# EAGLE design Syn-ShieldCarger-v07 (EAGLE 5.10)
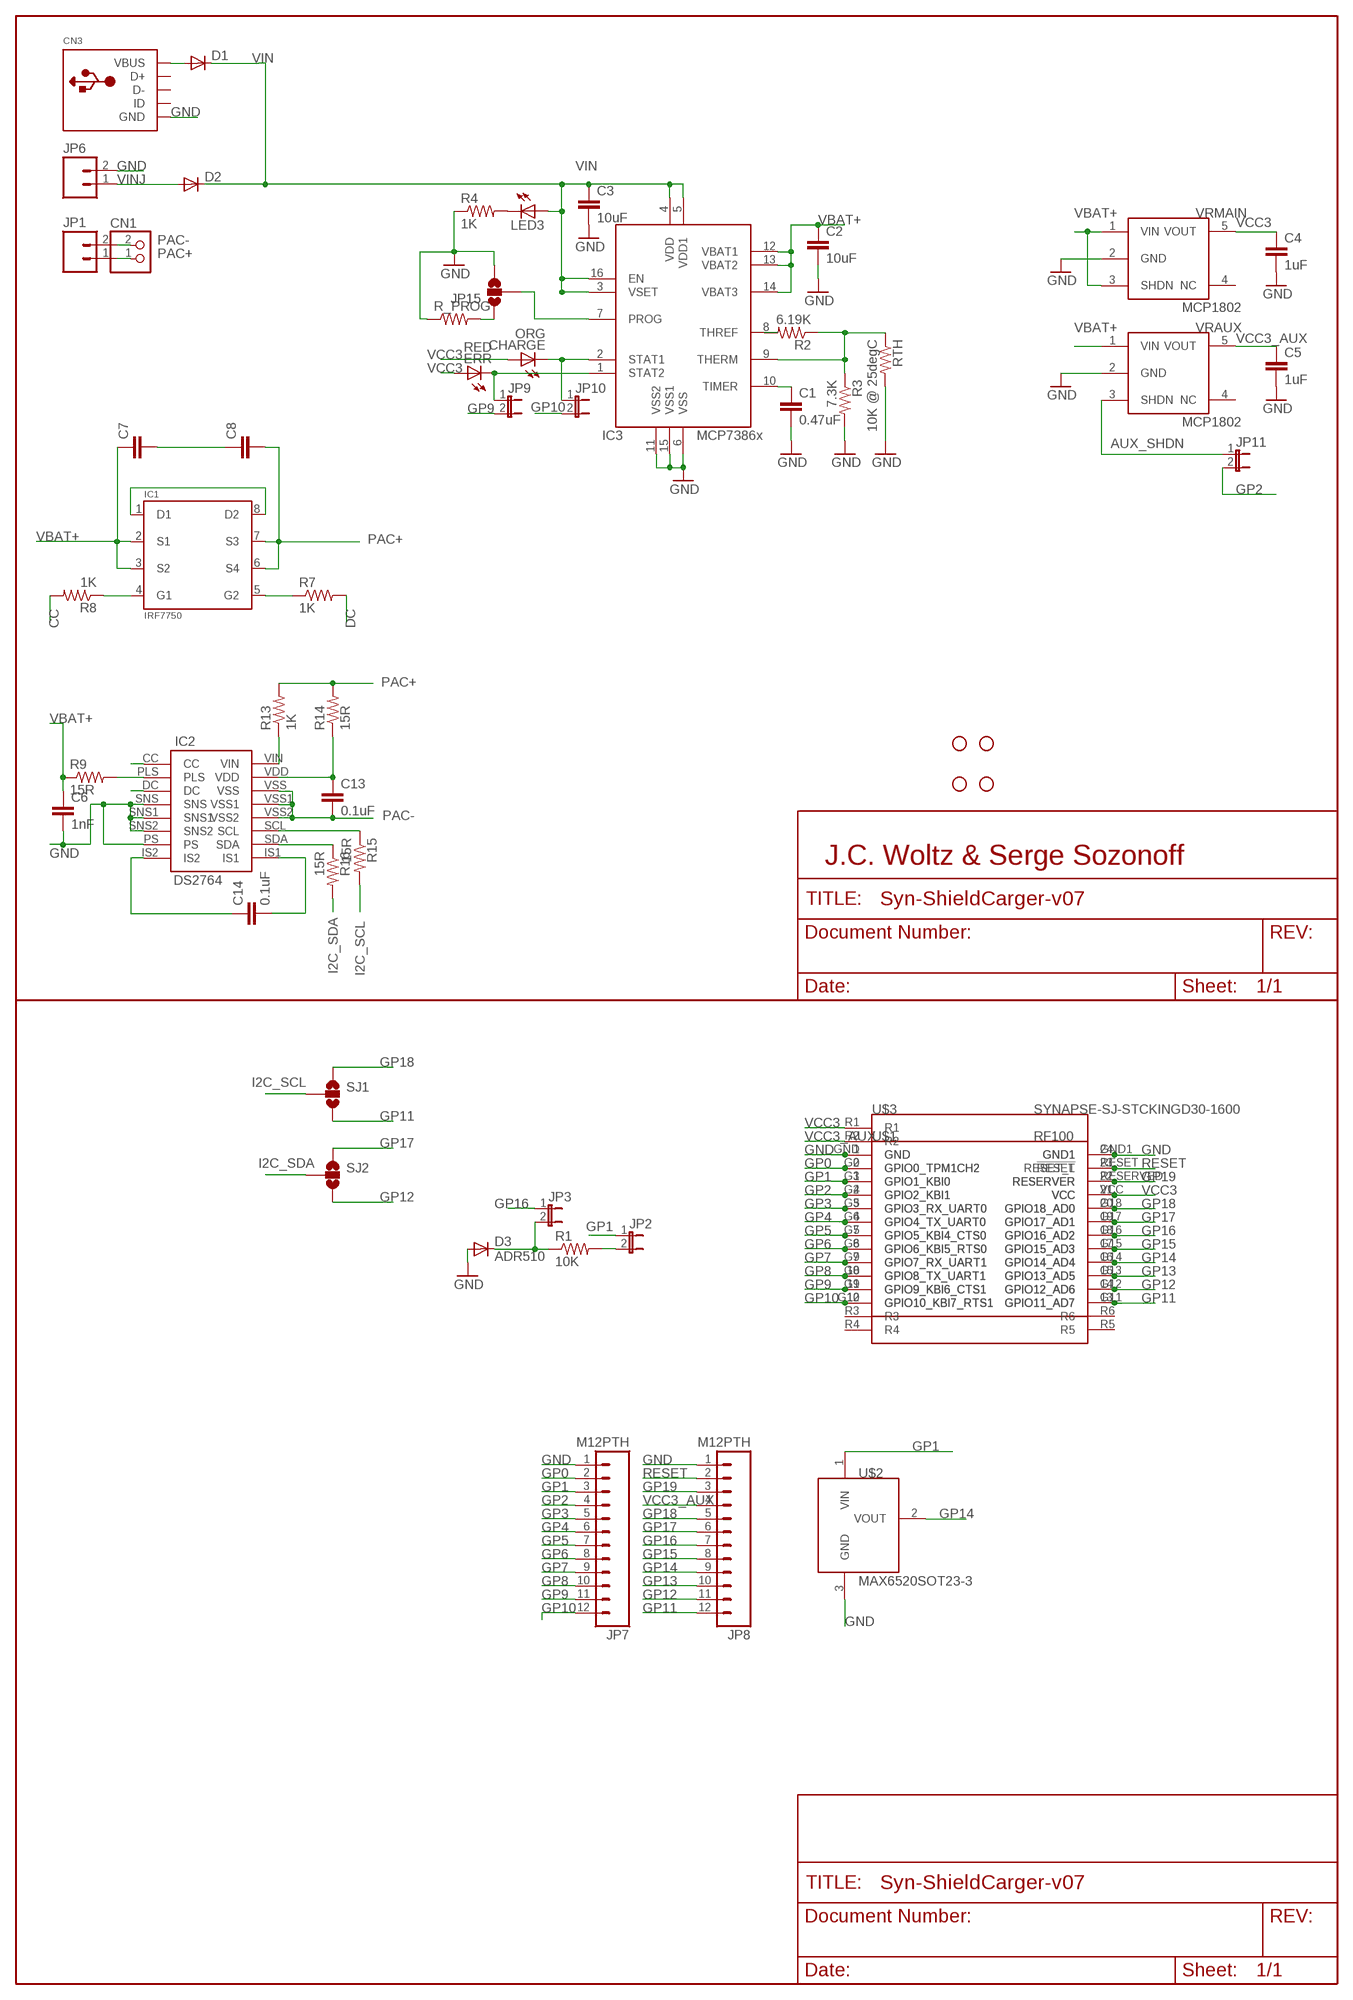
[diagram p0: schematic, sheet 1]

## Parts
C1  0.47uF  CAP0603-CAP  [0603-CAP]
C2  10uF  CAP1206  [1206]
C3  10uF  CAP1206  [1206]
C4  1uF  CAP0603-CAP  [0603-CAP]
C5  1uF  CAP0603-CAP  [0603-CAP]
C6  1nF  CAP0603-CAP  [0603-CAP]
C7  CAP0603-CAP  [0603-CAP]
C8  CAP0603-CAP  [0603-CAP]
C13  0.1uF  CAP0603-CAP  [0603-CAP]
C14  0.1uF  CAP0603-CAP  [0603-CAP]
CHARGE  ORG  LEDCHIPLED_0603  [CHIPLED_0603]
CN1  JST_2PIN-THM-RA  [JST-PH-2-THM-RA]
CN3  USBMINIB  [USB-MINIB]
D1  DIODESOD  [SOD-323]
D2  DIODESMA  [SMA-DIODE]
D3  ADR510  DIODESOT-23-3-ADR510  [SOT23-3]
ERR  RED  LEDCHIPLED_0603  [CHIPLED_0603]
IC1  IRF7750  [TSSOP8-4.4MM]
IC2  DS2764  [DS2764]
IC3  MCP73861SO16  [SO16-150MIL]
JP1  M02PTH  [1X02]
JP2  JUMPER-2SMD-NC  [SJ_2S]
JP3  JUMPER-2SMD-NC  [SJ_2S]
JP4  STAND-OFF  [STAND-OFF]
JP5  STAND-OFF  [STAND-OFF]
JP6  M023.5MM  [SCREWTERMINAL-3.5MM-2]
JP7  M12PTH  [1X12]
JP8  M12PTH  [1X12]
JP9  JUMPER-2SMD-NC  [SJ_2S]
JP10  JUMPER-2SMD-NC  [SJ_2S]
JP11  JUMPER-2SMD-NC  [SJ_2S]
JP12  STAND-OFF  [STAND-OFF]
JP15  SOLDERJUMPER_2WAYT  [SJ_2]
JP17  STAND-OFF  [STAND-OFF]
LED3  LEDCHIPLED_0603  [CHIPLED_0603]
R1  10K  RESISTOR0603-RES  [0603-RES]
R2  6.19K  RESISTOR0603-RES  [0603-RES]
R3  7.3K  RESISTOR0603-RES  [0603-RES]
R4  1K  RESISTOR0603-RES  [0603-RES]
R7  1K  RESISTOR0603-RES  [0603-RES]
R8  1K  RESISTOR0603-RES  [0603-RES]
R9  15R  RESISTOR0603-RES  [0603-RES]
R13  1K  RESISTOR0603-RES  [0603-RES]
R14  15R  RESISTOR0603-RES  [0603-RES]
R15  15R  RESISTOR0603-RES  [0603-RES]
R16  15R  RESISTOR0603-RES  [0603-RES]
R_PROG  RESISTORAXIAL-0603  [AXIAL-0603]
RTH  10K @ 25degC  RESISTORAXIAL-0603  [AXIAL-0603]
SJ1  SOLDERJUMPER_2WAYS  [SJ_3]
SJ2  SOLDERJUMPER_2WAYS  [SJ_3]
U$1  SYNAPSEWIRELESS-RFENGINESTD  SYNAPSEWIRELESS-RFENGINESTDTHM  [SYNAPSERFENGINE-THM]
U$2  MAX6520SOT23-3  [SOT23-3]
U$3  SYNAPSE-SJ-STCKINGD30-1600  [SYNSJ-STACK]
VRAUX  MCP1802  [SOT23-5]
VRMAIN  MCP1802  [SOT23-5]

## Nets
AUX_SHDN: JP11.1 VRAUX.3(SHDN)
CC: IC2.CC R8.2
DC: IC2.DC R7.2
GND: C1.2 C2.2 C3.2 C4.2 C5.2 C6.2 CN3.GND D3.2(A) IC2.PS IC2.SNS IC2.SNS1 IC2.SNS2 IC3.6(VSS) IC3.11(VSS2) IC3.15(VSS1) JP6.2 JP7.1 JP8.1 JP15.3 R3.2 R4.1 R_PROG.P$1 RTH.P$2 U$1.1(GND) U$1.24(GND1) U$2.3(GND) U$3.GND U$3.GND1 VRAUX.2(GND) VRMAIN.2(GND)
GP0: JP7.2 U$1.2(GPIO0_TPM1CH2) U$3.G0(GPIO0_TPM1CH2)
GP1: JP2.1 JP7.3 U$1.3(GPIO1_KBI0) U$2.1(VIN) U$3.G1(GPIO1_KBI0)
GP2: JP7.4 JP11.2 U$1.4(GPIO2_KBI1) U$3.G2(GPIO2_KBI1)
GP3: JP7.5 U$1.5(GPIO3_RX_UART0) U$3.G3(GPIO3_RX_UART0)
GP4: JP7.6 U$1.6(GPIO4_TX_UART0) U$3.G4(GPIO4_TX_UART0)
GP5: JP7.7 U$1.7(GPIO5_KBI4_CTS0) U$3.G5(GPIO5_KBI4_CTS0)
GP6: JP7.8 U$1.8(GPIO6_KBI5_RTS0) U$3.G6(GPIO6_KBI5_RTS0)
GP7: JP7.9 U$1.9(GPIO7_RX_UART1) U$3.G7(GPIO7_RX_UART1)
GP8: JP7.10 U$1.10(GPIO8_TX_UART1) U$3.G8(GPIO8_TX_UART1)
GP9: JP7.11 JP9.2 U$1.11(GPIO9_KBI6_CTS1) U$3.G9(GPIO9_KBI6_CTS1)
GP10: JP7.12 JP10.2 U$1.12(GPIO10_KBI7_RTS1) U$3.G10(GPIO10_KBI7_RTS1)
GP11: JP8.12 SJ1.3 U$1.13(GPIO11_AD7) U$3.G11(GPIO11_AD7)
GP12: JP8.11 SJ2.3 U$1.14(GPIO12_AD6) U$3.G12(GPIO12_AD6)
GP13: JP8.10 U$1.15(GPIO13_AD5) U$3.G13(GPIO13_AD5)
GP14: JP8.9 U$1.16(GPIO14_AD4) U$2.2(VOUT) U$3.G14(GPIO14_AD4)
GP15: JP8.8 U$1.17(GPIO15_AD3) U$3.G15(GPIO15_AD3)
GP16: JP3.1 JP8.7 U$1.18(GPIO16_AD2) U$3.G16(GPIO16_AD2)
GP17: JP8.6 SJ2.1 U$1.19(GPIO17_AD1) U$3.G17(GPIO17_AD1)
GP18: JP8.5 SJ1.1 U$1.20(GPIO18_AD0) U$3.G18(GPIO18_AD0)
GP19: JP8.3 U$1.22(RESERVER) U$3.RESERVED(RESERVER)
I2C_SCL: R15.2 SJ1.2
I2C_SDA: R16.2 SJ2.2
N$1: IC1.1(D1) IC1.8(D2)
N$2: LED3.C R4.2
N$3: D3.1(C) JP3.2 R1.1
N$4: JP2.2 R1.2
N$5: IC1.4(G1) R8.1
N$6: IC3.7(PROG) JP15.2
N$7: IC3.8(THREF) R2.2
N$8: IC3.9(THERM) R2.1 R3.1 RTH.P$1
N$9: C1.1 IC3.10(TIMER)
N$10: JP15.1 R_PROG.P$2
N$14: IC1.5(G2) R7.1
N$15: IC2.VIN R13.1
N$16: C14.2 IC2.IS1
N$17: IC2.SCL R15.1
N$18: C13.1 IC2.VDD R14.1
N$19: C7.2 C8.1
N$21: CN3.VBUS D1.2(A)
N$24: C14.1 IC2.IS2
N$25: IC2.SDA R16.1
PAC+: C8.2 CN1.1 IC1.6(S4) IC1.7(S3) JP1.1 R13.2 R14.2
PAC-: C13.2 CN1.2 IC2.VSS IC2.VSS1 IC2.VSS2 JP1.2
PLS: IC2.PLS R9.2
RESET: JP8.2 U$1.23(RESET_L) U$3.RESET(!RESET)
STAT1: CHARGE.C IC3.2(STAT1) JP10.1
STAT2: ERR.C IC3.1(STAT2) JP9.1
VBAT+: C2.1 C6.1 C7.1 IC1.2(S1) IC1.3(S2) IC3.12(VBAT1) IC3.13(VBAT2) IC3.14(VBAT3) R9.1 VRAUX.1(VIN) VRMAIN.1(VIN) VRMAIN.3(SHDN)
VCC3: C4.1 CHARGE.A ERR.A U$1.21(VCC) U$3.R1 U$3.VCC VRMAIN.5(VOUT)
VCC3_AUX: C5.1 JP8.4 U$3.R2 VRAUX.5(VOUT)
VIN: C3.1 D1.1(C) D2.C IC3.3(VSET) IC3.4(VDD) IC3.5(VDD1) IC3.16(EN) LED3.A
VINJ: D2.A JP6.1
Unconnected: CN3.D+ CN3.D- CN3.ID U$3.R3 U$3.R4 U$3.R5 U$3.R6 VRAUX.4(NC) VRMAIN.4(NC)

## Notes on the sheet
- J.C. Woltz & Serge Sozonoff

## Library data of the parts
C1-C8 C13 C14 = SparkFun:CAP: Capacitor Standard 0603 ceramic capacitor, and 0.1" leaded capacitor.
CHARGE ERR LED3 = adafruit:LED: LED OSRAM: - CHIPLED LG R971, LG N971, LY N971, LG Q971, LY Q971, LO R971, LY R971 LH N974, LH R974 LS Q976, LO Q976, LY Q976 LO Q996 - Hyper CHIPLED LW Q18S LB Q993, LB Q99A, LB R99A - SideLED LS A670, LO A670, LY A670, LG A670, LP A670 LB A673, LV A673, LT A673, LW A673 LH A674 LY A675 LS A676, LA A676, LO A676, LY A676, LW A676 LS A679, LY A679, LG A679 - Hyper Micro SIDELED® LS Y876, LA Y876, LO Y876, LY Y876 LT Y87S - SmartLED LW L88C, LW L88S LB L89C, LB L89S, LG L890 LS L89K, LO L89K, LY L89K LS L896, LA L896, LO L896, LY L896 - TOPLED LS T670, LO T670, LY T670, LG T670, LP T670 LSG T670, LSP T670, LSY T670, LOP T670, LYG T670 LG T671, LOG T671, LSG T671 LB T673, LV T673, LT T673, LW T673 LH T674 LS T676, LA T676, LO T676, LY T676, LB T676, LH T676, LSB T676, LW T676 LB T67C, LV T67C, LT T67C, LS T67K, LO T67K, LY T67K, LW E67C LS E67B, LA E67B, LO E67B, LY E67B, LB E67C, LV E67C, LT E67C LW T67C LS T679, LY T679, LG T679 LS T770, LO T770, LY T770, LG T770, LP T770 LB T773, LV T773, LT T773, LW T773 LH T774 LS E675, LA E675, LY E675, LS T675 LS T776, LA T776, LO T776, LY T776, LB T776 LHGB T686 LT T68C, LB T68C - Hyper Mini TOPLED® LB M676 - Mini TOPLED Santana® LG M470 LS M47K, LO M47K, LY M47K Source: http://www.osram.convergy.de/
CN1 = adafruit:JST_2PIN: JST 2-Pin Connectors of various flavors SMT-RA (S2B-PH-SM4) 4UConnector #17311 SMT (B2B-PH-SM4) THM-RA (S2B-PH) THM (B2B-PH)
CN3 = adafruit:USB: USB Connectors USBMINIB - Surface Mount Female Mini-B USB Connector 4UConnector: 06564 By microbuilder.eu Thru-hole RA Female Mini-B USB Connector 4UConnector: 18732 By ladyada.net
D1 D2 = SparkFun:DIODE: Diode These are standard reverse protection diodes and small signal diodes. SMA package can handle up to about 1A. SOD-323 can handle about 200mA. What the SOD-323 package when ordering, there are some mfgs out there that are 5-pin packages.
D3 = 0_jc-modified:DIODE: Diode These are standard reverse protection diodes and small signal diodes. SMA package can handle up to about 1A. SOD-323 can handle about 200mA. What the SOD-323 package when ordering, there are some mfgs out there that are 5-pin packages.
IC1 = ssozonoff:IRF7750: HEXFET® power MOSFETs from International Rectifier utilize advanced processing techniques to achieve extremely low on-resistance per silicon area. This benefit, combined with the ruggedized device design, that International Rectifier is well known for, provides the designer with an extremely efficient and reliable device for battery and load management.
IC2 = ssozonoff:DS2764
IC3 = 0_jc-custom:MCP73861
JP1 JP6 = SparkFun:M02: Header 2 Standard 2-pin 0.1" header. Use with straight break away headers (SKU : PRT-00116), right angle break away headers (PRT-00553), swiss pins (PRT-00743), machine pins (PRT-00117), and female headers (PRT-00115). Molex polarized connector foot print use with SKU : PRT-08233 with associated crimp pins and housings.
JP2 JP3 JP9-JP11 = SparkFun:JUMPER-2: Jumper Basic 0.1" spaced jumper. Use with breakaway headers.
JP4 JP5 JP12 JP17 = SparkFun:STAND-OFF: Stand Off This is the mechanical footprint for a #4 phillips button head screw. Use the keepout ring to avoid running the screw head into surrounding components. SKU : PRT-00447
JP7 JP8 = SparkFun:M12: Header 12 Standard 12-pin 0.1" header. Use with straight break away headers (SKU : PRT-00116), right angle break away headers (PRT-00553), swiss pins (PRT-00743), machine pins (PRT-00117), and female headers (PRT-00115).
JP15 SJ1 SJ2 = SparkFun:SOLDERJUMPER_2WAY: Solder Jumper 2 way solder jumper
R1 R4 R7-R9 R13-R16 = SparkFun:RESISTOR: Resistor Basic schematic elements and footprints for 0603, 1206, and PTH 1/10th watt (small) resistors.
R2 R3 R_PROG RTH = 0_jc-custom:RESISTOR
U$1 = 0_jc-custom:SYNAPSEWIRELESS-RFENGINE
U$2 = 0_jc-custom:MAX6520
U$3 = 0_jc-custom:SYNAPSE-SJ-STCKING: Standard layout for expansion modules using Synapse Wireless boards
VRAUX VRMAIN = 0_jc-modified:MCP1802

## Board
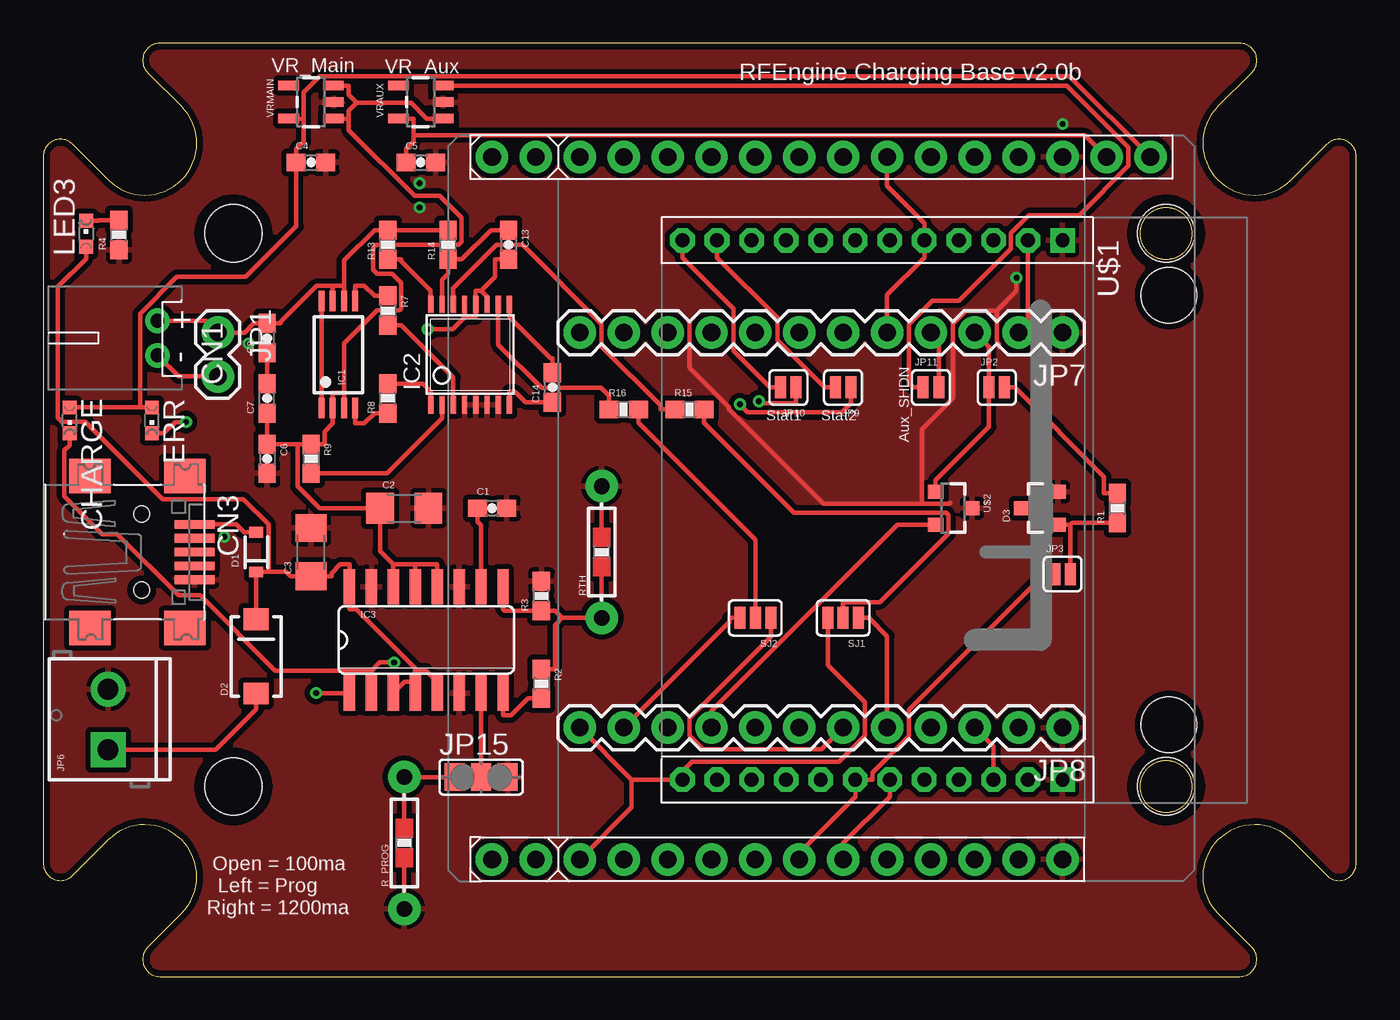
[diagram p1: board, top side]
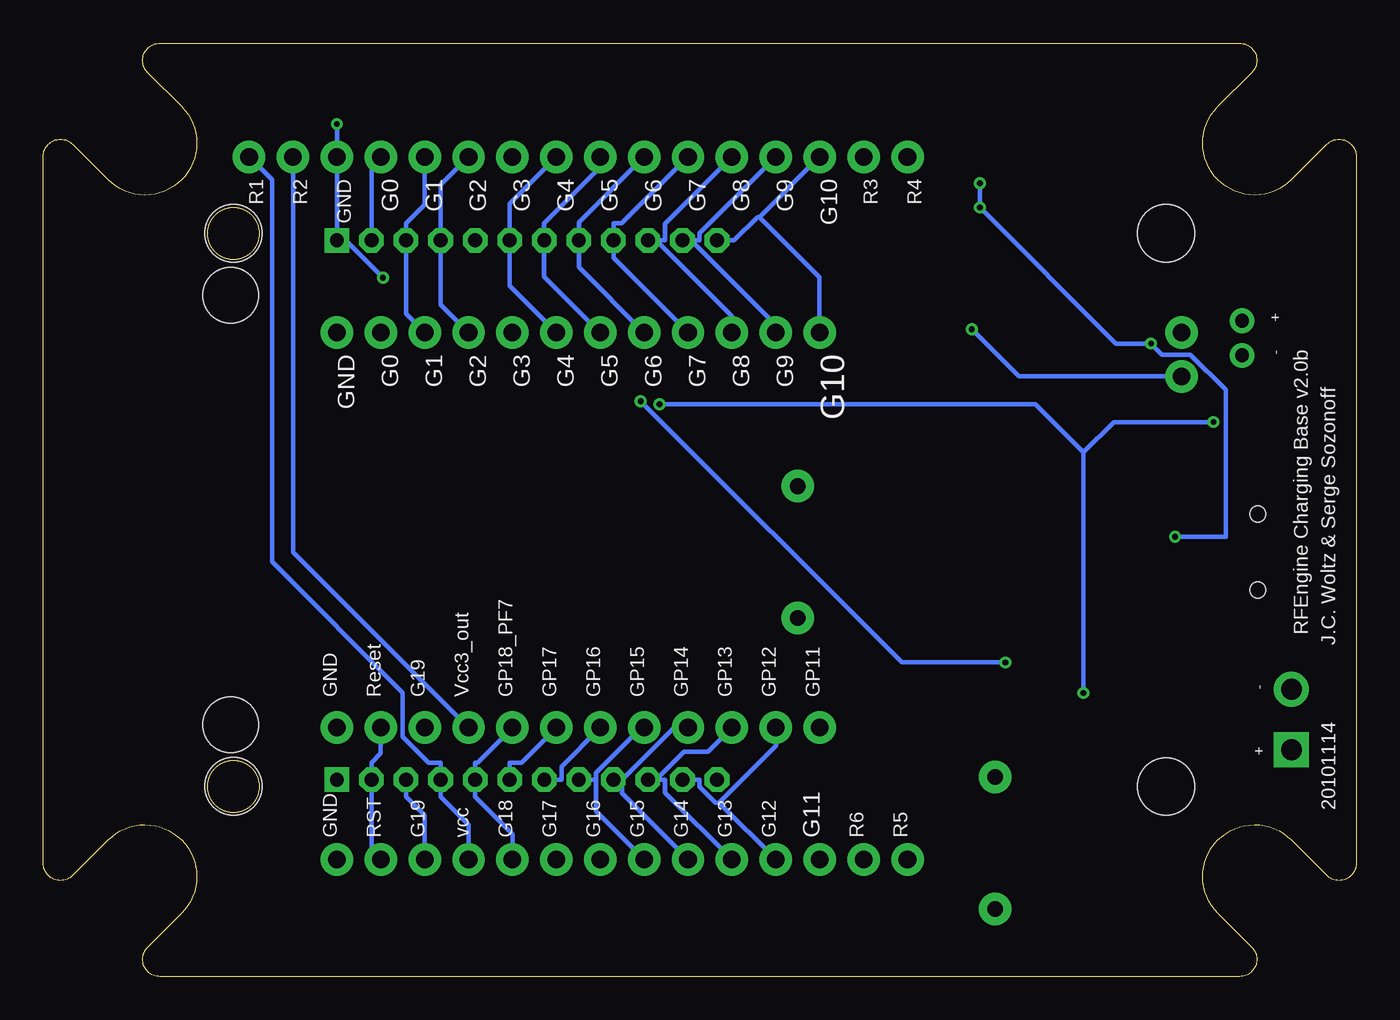
[diagram p2: board, bottom side, seen from below]

Size 76 x 54 mm. Coordinates in mm from the lower left corner, seen from the top.
Outline: 72.24,46.1 arc-180 68,50.34 69.95,52.29 arc135 69.24,54 6.75,54 arc135 6.05,52.29 8,50.34 arc-180 3.76,46.1 1.71,48.15 arc135 0,47.44 0,6.55 arc135 1.71,5.85 3.76,7.9 arc-180 8,3.66 6.05,1.71 arc135 6.75,0 69.24,0 arc135 69.95,1.71 68,3.66 arc-180 72.24,7.9 74.29,5.85 arc135 76,6.55 76,47.44 arc135 74.29,48.15 72.24,46.1
Outline: circle at 64.99,43 radius 1.5
Outline: circle at 64.99,11 radius 1.5
Copper layers (1*16): Top 0.0356mm / dielectric 1.5011mm / Bottom 0.0356mm
Design rules "LaenPCBOrder-JCModified *": minimum track width 10mil, minimum drill 13mil, track to track 10mil, track to pad 6mil, pad to pad 6mil, via to via 6mil, smd to smd 6mil, copper to edge 15mil, drill to drill 6mil, minimum pad ring 12mil, minimum via ring 7mil, stop-mask expansion 4mil, vias tented up to drill 25mil, thermal gap 10mil

### Footprints (pad centres in the part's own frame; a part is rotated, then mirrored left to right if it is on the bottom)
0603-CAP = smd 1.1 x 1: 1 -0.85,0; 2 0.85,0
1206 = smd 1.6 x 1.8: 1 -1.4,0; 2 1.4,0
CHIPLED_0603 = smd 0.8 x 0.8: A 0,-0.75; C 0,0.75
JST-PH-2-THM-RA = drill 0.8 pad 1.422 round: 1 1,0; 2 -1,0
USB-MINIB = smd 0.5 x 2.308: D+ 0,4.064; D- -0.8,4.064; GND 1.6,4.064; ID 0.8,4.064; VBUS -1.6,4.064 | smd 2 x 2.4: GND1 -4.4,-2; GND2 -4.4,3.5; GND3 4.4,3.5; GND4 4.4,-2 | hole 0.9: -2.2,1; 2.2,1
SOD-323 = smd 0.63 x 0.83: 1 -1.15,0; 2 1.15,0
SMA-DIODE = smd 1.27 x 1.47: A -2.15,0; C 2.15,0
SOT23-3 = smd 0.8 x 0.9: 1 -0.95,-1; 2 0.95,-1; 3 0,1.1
TSSOP8-4.4MM = smd 1.2 x 0.35: 1 -3.1,0.975; 2 -3.1,0.325; 3 -3.1,-0.325; 4 -3.1,-0.975; 5 3.1,-0.975; 6 3.1,-0.325; 7 3.1,0.325; 8 3.1,0.975
DS2764 = smd 0.305 x 0.991: CC -2.275,-2.918; DC -0.975,-2.918; IS1 2.275,2.918; IS2 2.275,-2.918; PLS -1.625,-2.918; PS 1.625,-2.918; SCL -0.975,2.918; SDA 1.625,2.918; SNS -0.325,-2.918; SNS1 0.325,-2.918; SNS2 0.975,-2.918; VDD -1.625,2.918; VIN -2.275,2.918; VSS -0.325,2.918; VSS1 0.325,2.918; VSS2 0.975,2.918
SO16-150MIL = smd 0.66 x 2.032: 1 -4.445,-3.073; 2 -3.175,-3.073; 3 -1.905,-3.073; 4 -0.635,-3.073; 5 0.635,-3.073; 6 1.905,-3.073; 7 3.175,-3.073; 8 4.445,-3.073; 9 4.445,3.073; 10 3.175,3.073; 11 1.905,3.073; 12 0.635,3.073; 13 -0.635,3.073; 14 -1.905,3.073; 15 -3.175,3.073; 16 -4.445,3.073
1X02 = drill 1.016 pad 1.88 round: 1 0,0; 2 2.54,0
SJ_2S = smd 0.635 x 1.27: 1 -0.45,0; 2 0.45,0
STAND-OFF = hole 3.302: 0,0
SCREWTERMINAL-3.5MM-2 = drill 1.2 pad 2.032 square: 1 0,0 | drill 1.2 pad 2.032 round: 2 3.5,0
1X12 = drill 1.016 pad 1.88 round: 1 0,0; 2 2.54,0; 3 5.08,0; 4 7.62,0; 5 10.16,0; 6 12.7,0; 7 15.24,0; 8 17.78,0; 9 20.32,0; 10 22.86,0; 11 25.4,0; 12 27.94,0
SJ_2 = smd 1.168 x 1.6: 1 -1.524,0; 2 0,0; 3 1.524,0
0603-RES = smd 1.1 x 1: 1 -0.85,0; 2 0.85,0
AXIAL-0603 = drill 0.9 pad 1.88 round: P$1 -3.81,0; P$2 3.81,0
SJ_3 = smd 0.635 x 1.27: 1 -0.889,0; 2 0,0; 3 0.889,0
SYNAPSERFENGINE-THM = drill 0.8 square: 1 0,0; 24 31.2,0 | drill 0.8 pad 1.422 octagon: 2 0,-2; 3 0,-4; 4 0,-6; 5 0,-8; 6 0,-10; 7 0,-12; 8 0,-14; 9 0,-16; 10 0,-18; 11 0,-20; 12 0,-22; 13 31.2,-22; 14 31.2,-20; 15 31.2,-18; 16 31.2,-16; 17 31.2,-14; 18 31.2,-12; 19 31.2,-10; 20 31.2,-8; 21 31.2,-6; 22 31.2,-4; 23 31.2,-2 | hole 3.2: 3.17,6.16; 28.03,6.16
SYNSJ-STACK = drill 1.016 pad 1.88 round: G0 0,-7.62; G1 0,-10.16; G2 0,-12.7; G3 0,-15.24; G4 0,-17.78; G5 0,-20.32; G6 0,-22.86; G7 0,-25.4; G8 0,-27.94; G9 0,-30.48; G10 0,-33.02; G11 40.64,-33.02; G12 40.64,-30.48; G13 40.64,-27.94; G14 40.64,-25.4; G15 40.64,-22.86; G16 40.64,-20.32; G17 40.64,-17.78; G18 40.64,-15.24; GND 0,-5.08; GND1 40.64,-5.08; R1 0,0; R2 0,-2.54; R3 0,-35.56; R4 0,-38.1; R5 40.64,-38.1; R6 40.64,-35.56; RESERVED 40.64,-10.16; RESET 40.64,-7.62; VCC 40.64,-12.7
SOT23-5 = smd 0.55 x 1.2: 1 -0.95,-1.3; 2 0,-1.3; 3 0.95,-1.3; 4 0.95,1.3; 5 -0.95,1.3

### Placement (x,y rotation side)
C1  25.98,27.1 0 top
C2  20.9,27.1 0 top
C3  15.5,24.56 90 top
C4  15.5,47.1 0 top
C5  21.85,47.1 0 top
C6  12.96,29.96 270 top
C7  12.96,33.45 90 top
C8  12.96,36.94 90 top
C13  26.93,42.34 270 top
C14  29.47,34.08 90 top
CHARGE  1.53,32.18 180 top
CN1  6.61,36.94 90 top
CN3  4.71,24.56 270 top
D1  12.33,24.56 90 top
D2  12.33,18.53 90 top
D3  57.73,27.1 90 top
ERR  6.29,32.18 180 top
IC1  17.09,35.99 90 top
IC2  24.71,35.99 0 top
IC3  22.17,19.48 0 top
JP1  10.1,37.26 270 top
JP2  55.19,34.08 0 top
JP3  59,23.29 0 top
JP4  64.99,43 0 top
JP5  11.01,43 0 top
JP6  3.75,13.13 90 top
JP7  59,37.26 180 top
JP8  59,14.4 180 top
JP9  46.3,34.08 180 top
JP10  43.12,34.08 180 top
JP11  51.38,34.08 0 top
JP12  64.99,11 0 top
JP15  25.34,11.54 0 top
JP17  11.01,11 0 top
LED3  2.48,42.97 0 top
R1  62.17,27.1 90 top
R2  28.84,16.94 270 top
R3  28.84,22.02 90 top
R4  4.39,42.91 90 top
R7  19.95,38.53 270 top
R8  19.95,33.45 90 top
R9  15.5,29.96 270 top
R13  19.95,42.34 90 top
R14  23.44,42.34 90 top
R15  37.41,32.81 0 top
R16  33.6,32.81 0 top
R_PROG  20.9,7.73 90 top
RTH  32.33,24.56 90 top
SJ1  46.3,20.75 180 top
SJ2  41.22,20.75 180 top
U$1  59,42.59 270 top
U$2  52.65,27.1 270 top
U$3  64.08,47.42 270 top
VRAUX  21.85,50.59 90 top
VRMAIN  15.5,50.59 90 top

### Tracks (layer width: path | path; a pad name or v marks a point on that pad's centre or on a via)
AUX_SHDN
  Top 0.254: JP11.1 50.33,34.08 50.11,34.31 50.11,37.75 51.47,39.11 53,39.11 56,42.11 56,43.01 57.05,44.06 59.97,44.06 62.81,46.9 62.81,47.97 59.24,51.54 VRAUX.3
CC
  Top 0.254: IC2.CC 22.43,33.84 21.98,34.3 R8.2
DC
  Top 0.254: R7.2 20.73,37.68 23.73,34.67 IC2.DC
GND  (via drill 0.33)
  Top 0.254: 50.87,27.35 52.4,27.35 52.51,27.41 | 50.87,27.35 45.16,27.35 39.7,32.81 39.7,32.94 37.41,35.23 37.41,37.77 37.41,37.84 | 50.87,27.35 50.87,31.67 52.65,33.45 52.65,37.77 53.41,38.53 55.19,38.53 | 55.19,38.53 55.19,36.75 55.32,36.62 55.32,36.5 55.32,36.42 | 55.19,38.53 56.33,39.67 v56.33,40.43
  Bottom 0.254: v56.33,40.43 59,43.1 U$3.GND v59,49.32 | v21.79,45.89 v21.79,44.5 13.91,36.62 v11.88,36.62 11.25,35.99 9.6,35.99 7.56,33.96 7.56,25.45 v10.49,25.45
  pour Top (isolate 0.305): -0.69,0.43 -0.69,53.77 75.51,53.77 75.51,0.43
GP0
  Top 0.254: U$1.2 57,37.8 JP7.2
  Bottom 0.254: U$3.G0 57,46.88 U$1.2
GP1
  Top 0.254: JP7.3 54.74,36.44 JP2.1 54.74,31.82 51.65,28.73 U$2.1
  Bottom 0.254: U$3.G1 53.92,44.66 55,43.58 U$1.3 55,38.34 JP7.3
GP2
  Top 0.254: JP11.2 51.83,36.81 JP7.4
  Bottom 0.254: JP7.4 53,38.88 U$1.4 53,45.8 U$3.G2
GP3
  Top 0.254: U$3.G3 48.84,45.74 51,43.58 U$1.5 51,41.6 48.84,39.44 JP7.5
GP4
  Bottom 0.254: JP7.6 49,39.96 U$1.6 49,44.72 U$3.G4
GP5
  Bottom 0.254: U$3.G5 43.76,46.82 47,43.58 U$1.7 47,40.5 JP7.7
GP6
  Bottom 0.254: JP7.8 45,41.04 U$1.8 45,43.64 U$3.G6
GP7
  Bottom 0.254: U$3.G7 42.51,43.58 43,43.58 U$1.9 43,41.6 38.68,37.28 JP7.9
GP8
  Bottom 0.254: 40.52,42.59 36.14,38.21 JP7.10 | 40.52,42.59 40.01,42.59 40.01,43.55 U$3.G8 | 40.52,42.59 U$1.10
GP9
  Top 0.254: U$1.11 39,41.6 42.49,38.11 42.49,36.8 45.21,34.08 JP9.2
  Bottom 0.254: 38.52,42.59 33.6,37.67 JP7.11 | 38.52,42.59 38.01,42.59 38.01,43.01 U$3.G9 | 38.52,42.59 U$1.11
GP10
  Top 0.254: JP10.2 42.08,34.08 39.95,36.21 39.95,38.65 37,41.6 U$1.12
  Bottom 0.254: 34.54,43.93 31.06,40.45 JP7.12 | U$1.12 36.01,42.59 34.67,43.93 34.54,43.93 | 34.54,43.93 U$3.G10
GP11
  Top 0.254: 36.5,11.39 37.55,12.43 46.07,12.43 47.57,13.93 47.57,15.86 45.41,18.02 SJ1.3 | 36.5,11.39 36.01,11.39 34.07,11.39 | 36.5,11.39 U$1.13 | 34.07,11.39 JP8.12 | U$3.G11 34.07,9.78 34.07,11.39
GP12
  Top 0.254: SJ2.3 39.73,20.75 39.73,20.53 JP8.11
  Bottom 0.254: 36.89,10.07 33.6,13.36 JP8.11 | 36.89,10.07 37.1,10.07 38.01,10.98 38.01,11.39 U$1.14 | U$3.G12 36.89,10.07
GP13
  Bottom 0.254: 40.52,11.39 38.9,13.01 37.53,13.01 JP8.10 | 40.52,11.39 40.01,11.39 40.01,10.65 U$3.G13 | 40.52,11.39 U$1.15
GP14
  Top 0.254: JP8.9 38.68,15.38 49.45,26.15 U$2.2
  Bottom 0.254: 42.5,11.39 39.5,14.4 JP8.9 | 42.5,11.39 42.52,11.39 U$1.16 | U$3.G14 42.5,10.6 42.5,11.39
GP15
  Bottom 0.254: U$3.G15 44.01,9.57 44.01,11.39 | 44.01,11.39 U$1.17 | 44.01,11.39 44.01,11.8 41.41,14.4 JP8.8
GP16
  Top 0.254: U$3.G16 43.76,7.16 47,10.4 U$1.18 47.99,11.39 47.99,11.78 50.11,13.9 50.11,15.44 57.95,23.29 JP3.1
  Bottom 0.254: U$1.18 46.01,11.39 46.01,12.15 JP8.7
GP17
  Top 0.254: JP8.6 45.06,13.15 38.2,13.15 37.41,13.94 37.41,14.95 42.11,19.65 SJ2.1 | U$1.19 49,10.4 46.3,7.7 U$3.G17
  Bottom 0.254: U$1.19 49,12.38 48.31,12.38 JP8.6
GP18
  Top 0.254: SJ1.1 47.79,20.75 48.84,19.69 JP8.5
  Bottom 0.254: U$3.G18 48.84,8.24 51,10.4 U$1.20 51,12.38 50.85,12.38 JP8.5
GP19
  Top 0.254: U$1.22 55,13.32 JP8.3
  Bottom 0.254: U$1.22 55,10.4 53.92,9.32 U$3.RESERVED
I2C_SCL
  Top 0.254: R15.2 38.26,32.03 43.47,26.83 52.27,26.83 52.38,26.72 52.38,25.61 48.43,21.66 46.3,21.66 SJ1.2
I2C_SDA
  Top 0.254: R16.2 34.45,32.03 41.22,25.26 SJ2.2
N$1
  Top 0.254: IC1.1 IC1.8
N$2
  Top 0.254: LED3.C 3.16,43.72 3.2,43.76 R4.2
N$3
  Top 0.254: JP3.2 59.45,24.2 59.46,24.21 59.46,26.15 | 59.46,26.15 D3.1 | R1.1 59.56,26.25 59.46,26.15
N$4
  Top 0.254: JP2.2 56.24,34.08 61.4,28.92 61.4,27.95 R1.2
N$5
  Top 0.254: R8.1 19.17,32.6 18.58,32.01 18.06,32.01 IC1.4
N$6
  Top 0.254: JP15.2 IC3.7
N$7
  Top 0.254: R2.2 28.06,16.09 27.08,15.11 26.61,15.11 IC3.8
N$8
  Top 0.254: 30.04,20.75 29.62,21.17 R3.1 26.7,21.17 26.61,21.26 IC3.9 | 30.04,20.75 RTH.P$1 | 30.04,20.75 29.62,20.33 29.62,17.79 R2.1
N$9
  Top 0.254: C1.1 25.13,26.32 25.34,26.1 IC3.10
N$10
  Top 0.254: R_PROG.P$2 JP15.1
N$14
  Top 0.254: R7.1 19.17,39.38 18.58,39.97 18.06,39.97 IC1.5
N$15
  Top 0.254: IC2.VIN 22.43,39.68 20.73,41.39 20.73,41.49 R13.1
N$16
  Top 0.254: C14.2 29.47,35.76 29.35,35.76 26.98,38.13 IC2.IS1
N$17
  Top 0.254: IC2.SCL 23.73,39.82 26.24,42.33 27.75,42.33 32.33,37.75 32.33,36.44 35.73,33.04 35.73,32.81 R15.1
N$18
  Top 0.254: IC2.VDD 23.08,40.3 23.44,40.66 R14.1 24.22,41.49 25.92,43.19 C13.1
N$19
  Top 0.254: C7.2 C8.1
N$21
  Top 0.254: D1.2 11.63,25.71 11.18,26.16 CN3.VBUS
N$24
  Top 0.254: IC2.IS2 26.98,33.84 27.31,33.84 27.92,33.23 C14.1
N$25
  Top 0.254: R16.1 32.75,33.59 32.28,34.06 28.84,34.06 26.33,36.56 IC2.SDA
PAC+
  Top 0.254: CN1.1 9.42,37.94 JP1.1 11.65,37.26 12.18,37.79 C8.2 13.74,37.79 13.74,37.89 15.82,39.97 16.76,39.97 | 17.41,39.97 IC1.6 | 17.41,39.97 17.41,41.43 19.17,43.19 R13.2 R14.2 | 16.76,39.97 IC1.7 | 16.76,39.97 17.41,39.97
PAC-  (via drill 0.33 pad 0.69)
  Top 0.254: v22.26,37.45 23.7,37.45 24.38,38.13 | C13.2 26.15,41.49 26.15,40.49 25.35,39.68 | 25.35,39.68 25.03,39.68 IC2.VSS1 25.03,38.13 24.38,38.13 | 25.35,39.68 25.68,39.34 25.68,39.23 IC2.VSS2 | 24.38,38.13 IC2.VSS | JP1.2 7.83,34.72 CN1.2
  Bottom 0.254: JP1.2 19.53,34.72 v22.26,37.45
PLS
  Top 0.254: IC2.PLS 23.08,32.29 19.89,29.1 R9.2
RESET
  Bottom 0.254: JP8.2 56.46,12.92 57,12.38 U$1.23 57,7.32 U$3.RESET
STAT1  (via drill 0.33 pad 0.69)
  Top 0.254: v41.42,33.29 41.54,33.17 43.57,33.17 JP10.1 | v20.31,18.17 19.46,18.17 18.99,17.7 | CHARGE.C 1.53,30.75 1.23,30.44 1.23,27.79 3.42,25.6 4.28,25.6 7.83,22.05 9.09,22.05 13.43,17.7 18.99,17.7 | 18.99,17.7 IC3.2
  Bottom 0.254: v20.31,18.17 26.3,18.17 v41.42,33.29
STAT2  (via drill 0.33 pad 0.69)
  Top 0.254: v40.32,33.11 40.77,32.66 46.24,32.66 46.75,33.17 JP9.1 | ERR.C 6.97,31.43 7.63,32.08 v8.27,32.08 | v15.79,16.4 IC3.1
  Bottom 0.254: 15.79,30.33 18.57,33.11 v40.32,33.11 | 15.79,30.33 14.04,32.08 v8.27,32.08 | v15.79,16.4 15.79,30.33
VBAT+
  Top 0.254: 17.68,49.64 17.68,48.97 21.48,45.17 22.94,45.17 24.22,43.89 24.22,42.52 24.04,42.34 19.27,42.34 19.09,42.16 19.09,40.88 19.32,40.66 20.2,40.66 20.73,40.13 20.73,38.65 20.63,38.55 19.31,38.55 17.41,36.65 17.41,33.77 | 18.14,50.56 17.68,50.1 17.68,49.64 | 20.26,23.85 19.5,24.61 C2.1 16,27.1 14.72,28.37 14.72,30.81 | 14.72,30.81 C6.1 C7.1 | 14.72,30.81 R9.1 16.28,30.81 16.28,31.53 16.76,32.01 IC1.2 16.76,33.03 16.76,33.77 17.41,33.77 | 18.14,50.56 21.28,50.56 22.2,49.64 VRAUX.1 | 18.14,50.56 17.68,51.02 17.68,51.54 VRMAIN.3 | 17.68,49.64 VRMAIN.1 | 17.41,33.77 17.41,33.33 IC1.3 | IC3.12 22.8,23.85 21.53,23.85 | 20.26,23.85 21.53,23.85 | 21.53,23.85 IC3.13 | 20.26,23.85 IC3.14
VCC3
  Top 0.254: U$3.R1 59.4,52.1 16.01,52.1 15.08,51.17 15.08,49.64 | 15.08,49.64 VRMAIN.5 | 15.08,49.64 15.08,48.31 14.65,47.88 C4.1 14.65,43.4 11.73,40.48 7.72,40.48 5.6,38.35 5.6,32.93 | CHARGE.A 5.6,32.93 | 5.6,32.93 ERR.A
  Bottom 0.254: U$3.R1 62.76,46.09 62.76,23.99 55.19,16.42 55.19,13.87 53.7,12.38 53,12.38 U$1.21 53,10.4 51.38,8.78 U$3.VCC
VCC3_AUX
  Top 0.254: 21.43,48.66 21.43,48.31 21,47.88 C5.1 | 21.43,48.66 21.43,49.64 VRAUX.5 | 21.43,48.66 60.3,48.66 U$3.R2
  Bottom 0.254: U$3.R2 61.54,24.56 JP8.4
VIN
  Top 0.254: 21.53,17.05 20.91,17.05 IC3.3 | 21.53,17.7 21.53,17.05 | 21.53,17.05 IC3.4 | 21.53,17.7 21.53,17.83 18.11,21.26 17.72,21.26 IC3.16 17.72,23.85 17.2,23.85 16.68,23.33 16.68,23.16 C3.1 14.32,23.16 14.07,23.41 13.04,23.41 | 21.53,17.7 22.16,17.7 22.8,17.05 IC3.5 | D2.C D1.1 13.04,23.41 | 13.04,23.41 13.04,26.16 11.57,27.62 6.92,27.62 2.43,32.11 1.09,32.11 0.85,32.34 0.85,39.91 2.48,41.54 LED3.A
VINJ
  Top 0.254: D2.A 12.33,15.46 9.99,13.13 JP6.1

### Text on the board
tPlace: VR_Main | VR_Aux | RFEngine Charging Base v2.0b | Stat1 | Stat2 | Aux_SHDN | Open = 100ma | Left = Prog | Right = 1200ma
bPlace: R4 | R3 | G10 | G9 | G8 | G7 | G6 | G5 | G4 | G3 | G2 | G1 | G0 | GND | R2 | R1 | + | - | G10 | G9 | G8 | G7 | G6 | G5 | G4 | G3 | G2 | G1 | G0 | GND | RFEngine Charging Base v2.0b | J.C. Woltz & Serge Sozonoff | - | GP11 | GP12 | GP13 | GP14 | GP15 | GP16 | GP17 | GP18_PF7 | Vcc3_out | G19 | Reset | GND | + | 20101114 | R5 | R6 | G11 | G12 | G13 | G14 | G15 | G16 | G17 | G18 | vcc | G19 | RST | GND